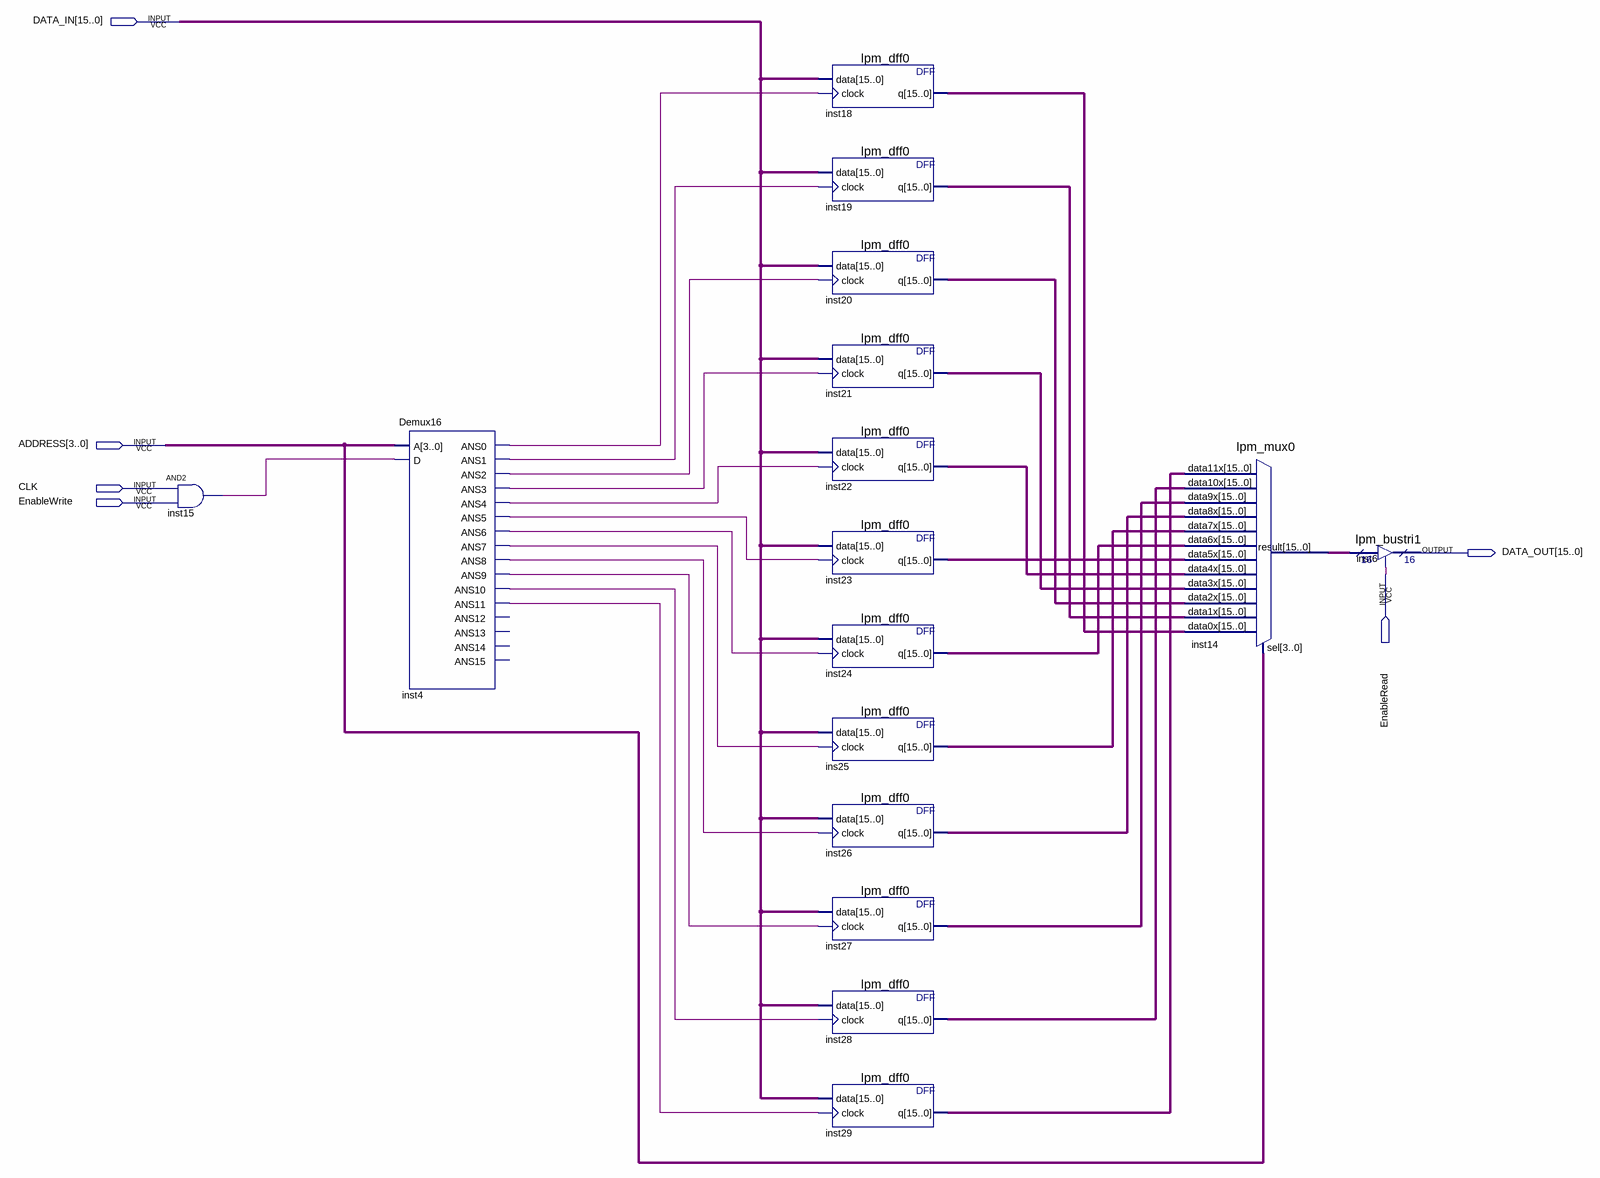
[diagram p0: schematic sheet]
// Quartus schematic GPR.bdf as structural Verilog: 16 symbols, 6 pins
module GPR (
  input  [15:0] DATA_IN,
  input  [3:0] ADDRESS,
  input  CLK,
  input  EnableWrite,
  input  EnableRead,
  output [15:0] DATA_OUT
);

  wire inst4_ans0, inst4_ans1, inst4_ans2, inst4_ans3, inst4_ans4, inst4_ans5, inst4_ans6, inst4_ans7,
       inst4_ans8, inst4_ans9, inst4_ans10, inst4_ans11, inst15_out;
  wire [15:0] ins25_q, inst14_result, inst18_q, inst19_q, inst20_q, inst21_q, inst22_q, inst23_q, inst24_q,
       inst26_q, inst27_q, inst28_q, inst29_q;

  and inst15 (inst15_out, CLK, EnableWrite);
  Demux16 inst4 (
    .A(ADDRESS), .D(inst15_out), .ANS0(inst4_ans0), .ANS1(inst4_ans1), .ANS2(inst4_ans2), .ANS3(inst4_ans3),
    .ANS4(inst4_ans4), .ANS5(inst4_ans5), .ANS6(inst4_ans6), .ANS7(inst4_ans7), .ANS8(inst4_ans8),
    .ANS9(inst4_ans9), .ANS10(inst4_ans10), .ANS11(inst4_ans11));  // open: ANS12, ANS13, ANS14, ANS15
  lpm_dff0 inst18 (.data(DATA_IN), .clock(inst4_ans0), .q(inst18_q));
  lpm_dff0 inst19 (.data(DATA_IN), .clock(inst4_ans1), .q(inst19_q));
  lpm_dff0 inst20 (.data(DATA_IN), .clock(inst4_ans2), .q(inst20_q));
  lpm_dff0 inst21 (.data(DATA_IN), .clock(inst4_ans3), .q(inst21_q));
  lpm_dff0 inst22 (.data(DATA_IN), .clock(inst4_ans4), .q(inst22_q));
  lpm_dff0 inst23 (.data(DATA_IN), .clock(inst4_ans5), .q(inst23_q));
  lpm_dff0 inst24 (.data(DATA_IN), .clock(inst4_ans6), .q(inst24_q));
  lpm_dff0 ins25 (.data(DATA_IN), .clock(inst4_ans7), .q(ins25_q));
  lpm_dff0 inst26 (.data(DATA_IN), .clock(inst4_ans8), .q(inst26_q));
  lpm_dff0 inst27 (.data(DATA_IN), .clock(inst4_ans9), .q(inst27_q));
  lpm_dff0 inst28 (.data(DATA_IN), .clock(inst4_ans10), .q(inst28_q));
  lpm_dff0 inst29 (.data(DATA_IN), .clock(inst4_ans11), .q(inst29_q));
  lpm_mux0 inst14 (
    .data11x(inst29_q), .data10x(inst28_q), .data9x(inst27_q), .data8x(inst26_q), .data7x(ins25_q),
    .data6x(inst24_q), .data5x(inst23_q), .data4x(inst22_q), .data3x(inst21_q), .data2x(inst20_q),
    .data1x(inst19_q), .data0x(inst18_q), .sel(ADDRESS), .result(inst14_result));
  lpm_bustri1 inst6 (.enabledt(EnableRead), .data(inst14_result), .tridata(DATA_OUT));
endmodule
